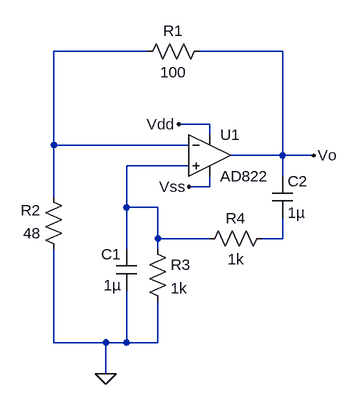
[diagram p0: schematic SineWaveGenerator.asc]
SineWaveGenerator.asc, the LTspice schematic file:
Version 4
SHEET 1 880 680
WIRE 112 -16 -32 -16
WIRE 320 -16 192 -16
WIRE 208 96 160 96
WIRE 208 112 208 96
WIRE -32 128 -32 -16
WIRE 176 128 -32 128
WIRE 320 144 320 -16
WIRE 320 144 240 144
WIRE 368 144 320 144
WIRE 176 160 80 160
WIRE 320 176 320 144
WIRE 208 192 208 176
WIRE 208 192 176 192
WIRE -32 208 -32 128
WIRE 80 224 80 160
WIRE 128 224 80 224
WIRE 128 272 128 224
WIRE 208 272 128 272
WIRE 320 272 320 240
WIRE 320 272 288 272
WIRE 80 288 80 224
WIRE 128 288 128 272
WIRE -32 432 -32 288
WIRE 48 432 -32 432
WIRE 80 432 80 352
WIRE 80 432 48 432
WIRE 128 432 128 368
WIRE 128 432 80 432
WIRE 48 480 48 432
FLAG 48 480 0
FLAG 160 96 Vdd
FLAG 176 192 Vss
FLAG 368 144 Vo
SYMBOL OpAmps\\AD822 208 80 R0
SYMATTR InstName U1
SYMBOL res 208 -32 R90
WINDOW 0 0 56 VBottom 2
WINDOW 3 32 56 VTop 2
SYMATTR InstName R1
SYMATTR Value 100
SYMBOL res -16 304 R180
WINDOW 0 36 76 Left 2
WINDOW 3 36 40 Left 2
SYMATTR InstName R2
SYMATTR Value 48
SYMBOL cap 96 352 R180
WINDOW 0 24 56 Left 2
WINDOW 3 24 8 Left 2
SYMATTR InstName C1
SYMATTR Value 1µ
SYMBOL res 112 272 R0
SYMATTR InstName R3
SYMATTR Value 1k
SYMBOL res 304 256 R90
WINDOW 0 0 56 VBottom 2
WINDOW 3 32 56 VTop 2
SYMATTR InstName R4
SYMATTR Value 1k
SYMBOL cap 304 176 R0
SYMATTR InstName C2
SYMATTR Value 1µ

The netlist it stands for:
* SineWaveGenerator.asc
XU1 N002 N001 Vdd Vss Vo AD822  ; pins In+ In- V+ V- OUT
R1 Vo N001 100
R2 0 N001 48
C1 0 N002 1µ
R3 N002 0 1k
R4 N003 N002 1k
C2 Vo N003 1µ
.backanno
.end